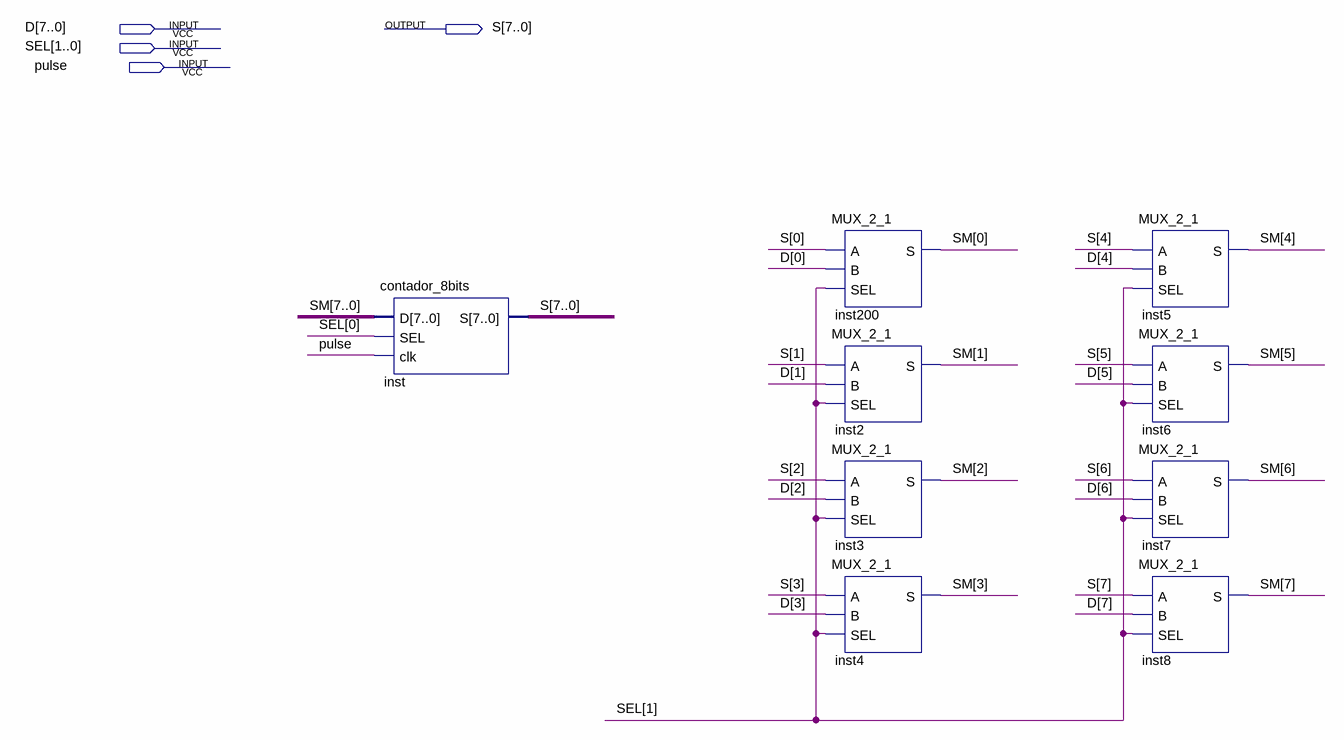
[diagram p0: schematic sheet]
// Quartus schematic PC.bdf as structural Verilog: 9 symbols, 4 pins
module PC (
  input  [7:0] D,
  input  [1:0] SEL,
  input  pulse,
  output [7:0] S
);

  wire [7:0] SM;

  contador_8bits inst (.D(SM), .SEL(SEL[0]), .clk(pulse), .S(S));
  MUX_2_1 inst200 (.A(S[0]), .B(D[0]), .SEL(SEL[1]), .S(SM[0]));
  MUX_2_1 inst2 (.A(S[1]), .B(D[1]), .SEL(SEL[1]), .S(SM[1]));
  MUX_2_1 inst3 (.A(S[2]), .B(D[2]), .SEL(SEL[1]), .S(SM[2]));
  MUX_2_1 inst4 (.A(S[3]), .B(D[3]), .SEL(SEL[1]), .S(SM[3]));
  MUX_2_1 inst5 (.A(S[4]), .B(D[4]), .SEL(SEL[1]), .S(SM[4]));
  MUX_2_1 inst6 (.A(S[5]), .B(D[5]), .SEL(SEL[1]), .S(SM[5]));
  MUX_2_1 inst7 (.A(S[6]), .B(D[6]), .SEL(SEL[1]), .S(SM[6]));
  MUX_2_1 inst8 (.A(S[7]), .B(D[7]), .SEL(SEL[1]), .S(SM[7]));
endmodule
